# Altium schematic sheet BatteryStepDown.SchDoc
size A4
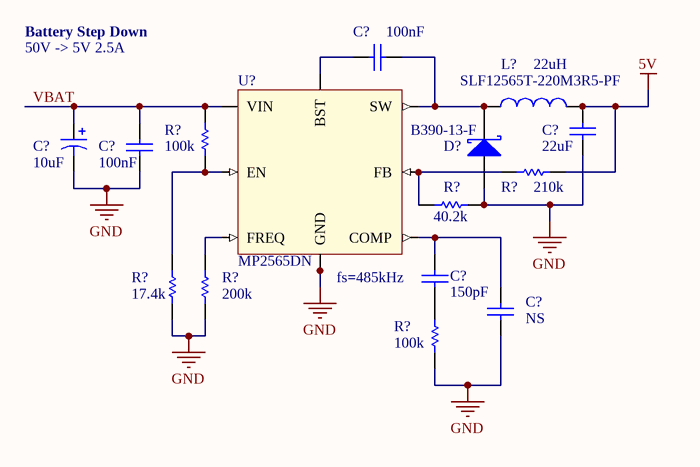
[diagram p0: BatteryStepDown.SchDoc]

## Parts
(Parts that share a designator on the sheet are numbered #1, #2 ... from top to bottom, then left to right.)
C?#1  value 100nF  [J1-0603]  (hidden comment: Cap)
C?#2  value 22uF  [J1-0603]  (hidden comment: Cap)
C?#3  value 10uF  [RAD-0.1]  (hidden comment: Cap Pol1)
C?#4  value 100nF  [J1-0603]  (hidden comment: Cap)
C?#5  value 150pF  [J1-0603]  (hidden comment: Cap)
C?#6  value NS  [J1-0603]  (hidden comment: Cap)
D?  B390-13-F  [B390]
L?  SLF12565T-220M3R5-PF  value 22uH  [0402-A]
R?#1  value 100k  [J1-0603]  (hidden comment: Res1)
R?#2  value 210k  [J1-0603]  (hidden comment: Res1)
R?#3  value 40.2k  [J1-0603]  (hidden comment: Res1)
R?#4  value 17.4k  [J1-0603]  (hidden comment: Res1)
R?#5  value 200k  [J1-0603]  (hidden comment: Res1)
R?#6  value 100k  [J1-0603]  (hidden comment: Res1)
U?  MP2565DN  [SOIC8E]

## Nets
5V: C?#2.1 L?.2 R?#2.1
GND: C?#2.2 C?#3.2 C?#4.1 C?#6.2 D?.1(A) R?#3.1 R?#4.1 R?#5.1 R?#6.1 U?.5(GND) U?.9(PAD)
VBAT: C?#3.1 C?#4.2 R?#1.2 U?.7(VIN)
NetC?#1_1: C?#1.1 D?.2(K) L?.1 U?.1(SW)
NetC?#1_2: C?#1.2 U?.8(BST)
NetC?#5_1: C?#5.1 C?#6.1 U?.3(COMP)
NetC?#5_2: C?#5.2 R?#6.2
NetR?#1_1: R?#1.1 R?#4.2 U?.2(EN)
NetR?#2_2: R?#2.2 R?#3.2 U?.4(FB)
NetR?#5_2: R?#5.2 U?.6(FREQ)

## Notes on the sheet
- Battery Step Down
- 50V -> 5V 2.5A
- (near U?) fs=485kHz

## Library data of the parts
C?#1 C?#2 C?#4-C?#6 = Cap: Capacitor; Published: 8-Jun-2000; LatestRevisionDate: 17-Jul-2002; LatestRevisionNote: Re-released for DXP Platform.; PackageReference: RAD-0.3; Publisher: Altium Limited; PackageDescription: Radial Cap, Thru-Hole; 2 Leads; 0.3 in Pin Spacing
  C?#1 C?#4: LCSC: C153795
  C?#2: LCSC: C109447
  C?#5 C?#6: LCSC: C37298
C?#3 = Cap Pol1: Polarized Capacitor (Radial); Published: 8-Jun-2000; LatestRevisionDate: 17-Jul-2002; LatestRevisionNote: Re-released for DXP Platform.; PackageReference: RB7.6-15; Publisher: Altium Limited; PackageDescription: Polarized Capacitor (Radial); 2 Leads; LCSC: C47878
D? = D Schottky: Schottky Diode; Published: 8-Jun-2000; LatestRevisionDate: 17-Jul-2002; LatestRevisionNote: Re-released for DXP Platform.; PackageReference: SMB; Publisher: Altium Limited; PackageDescription: DO-214-AA/SMB; 2 C-Bend Leads; Body 5.3 x 3.6 mm, inc. leads (LxW); Code_JEDEC: DO-214-AA; LCSC: C134458
L? = Inductor: Code_IEC: 1005; Published: 8-Jun-2000; LatestRevisionDate: 29-May-2009; LatestRevisionNote: IPC-7351 Footprint Added.; PackageReference: 0402-A; Publisher: Altium Limited; PackageDescription: Chip Inductor; Code_JEITA: 0402; LCSC: C136214
R?#1-R?#6 = Res1: Resistor; Published: 8-Jun-2000; LatestRevisionDate: 17-Jul-2002; LatestRevisionNote: Re-released for DXP Platform.; PackageReference: AXIAL-0.3; Publisher: Altium Limited; PackageDescription: Axial Device, Thru-Hole; 2 Leads; 0.3 in Pin Spacing
  R?#2: LCSC: C217875
  R?#3: LCSC: C209139
  R?#4: LCSC: C149944
U? = MP2565: LCSC: C12451